# EAGLE design Ad7124-4_FB_FeatherWing (EAGLE 9.6.2)
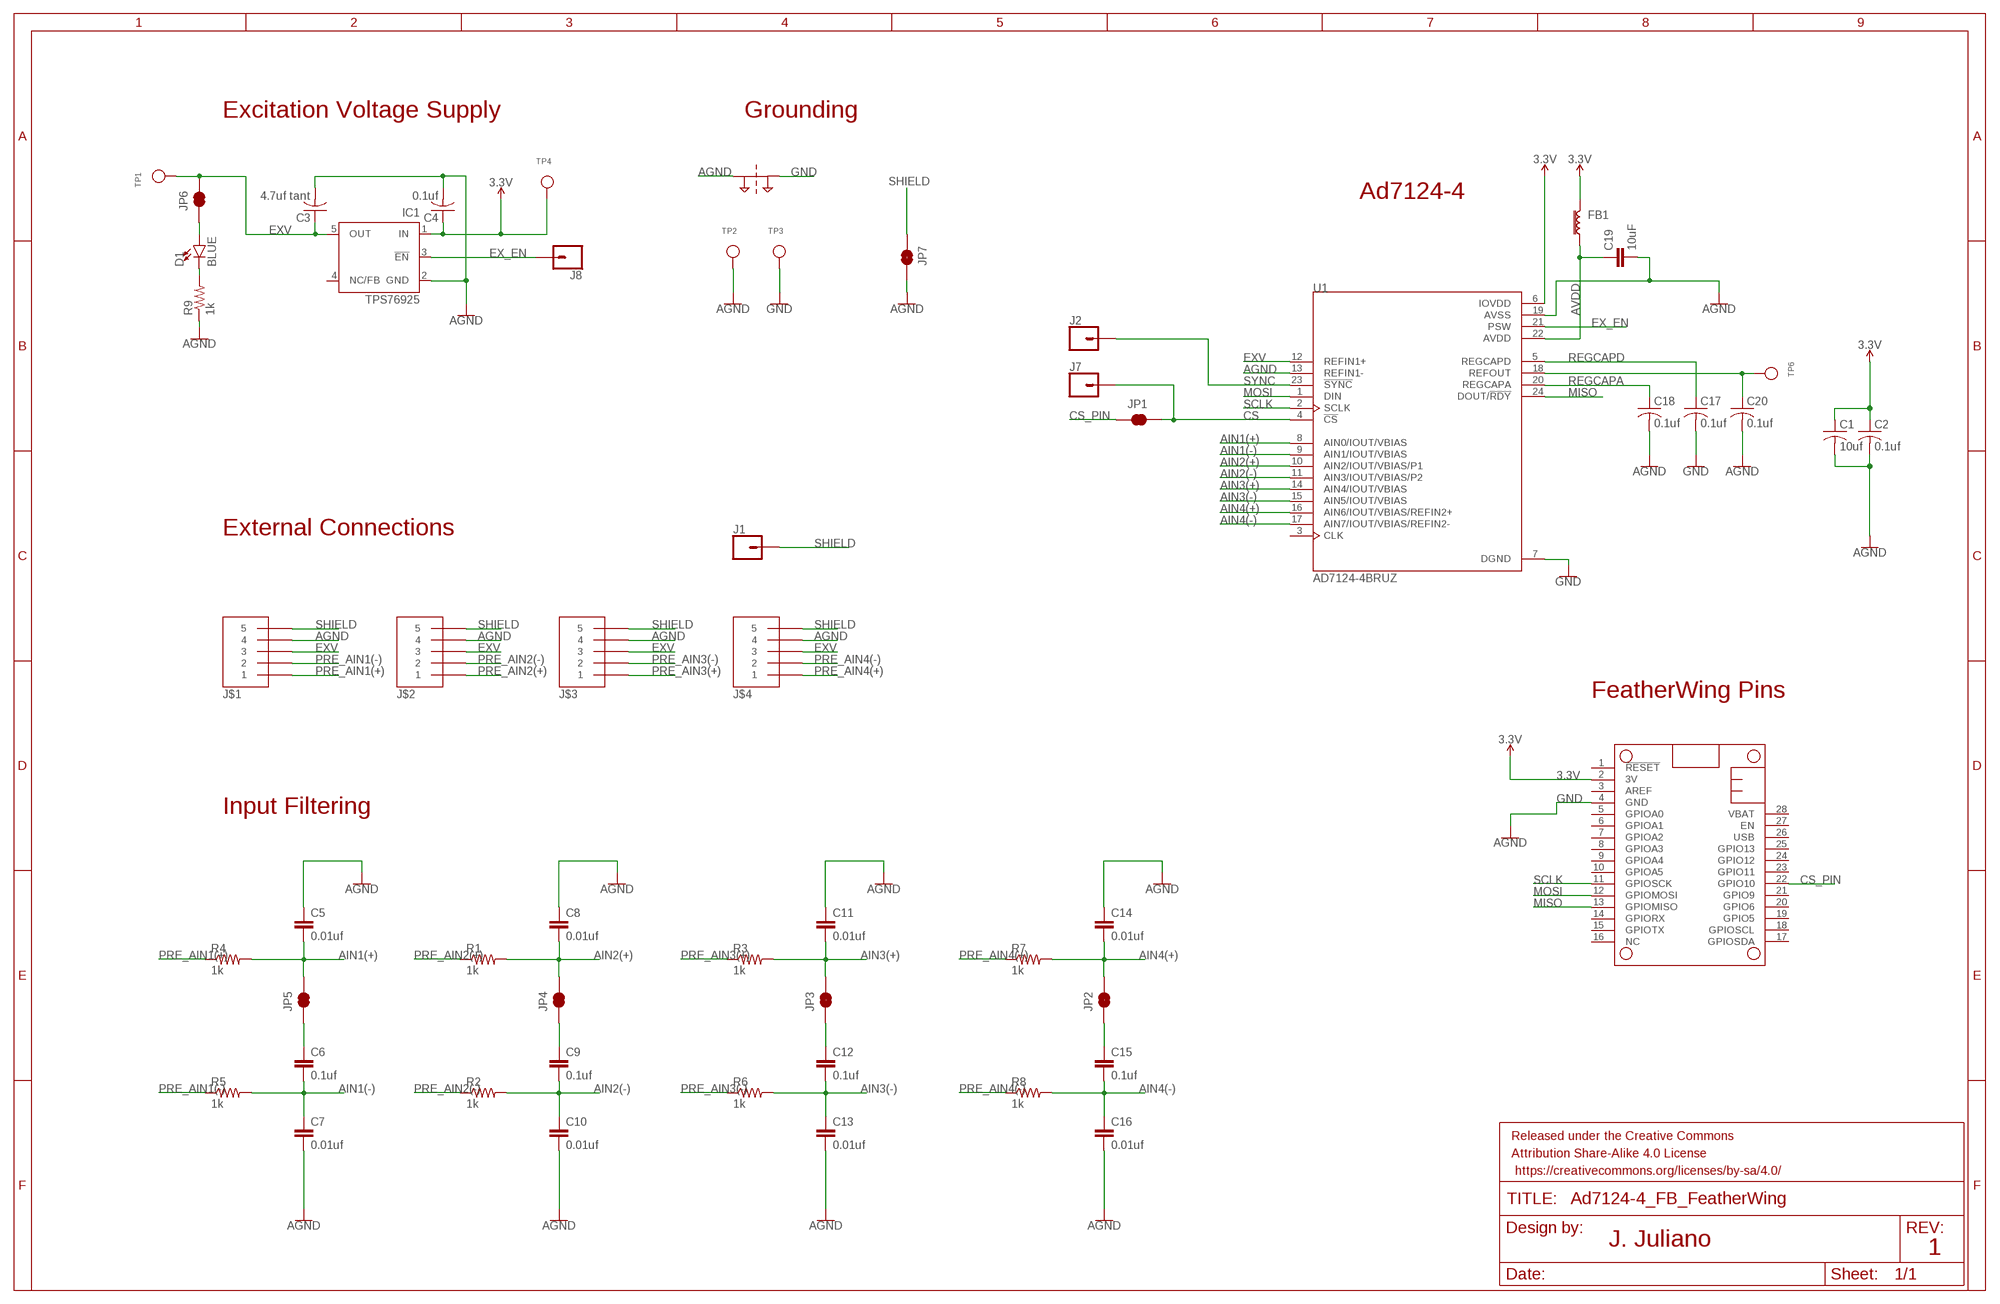
[diagram p0: schematic, sheet 1]

## Parts
C1  10uf  C-USC0603  [C0603]
C2  0.1uf  C-USC0603  [C0603]
C3  4.7uf tant  C-USC0603  [C0603]
C4  0.1uf  C-USC0603  [C0603]
C5  0.01uf  C-EUC0603  [C0603]
C6  0.1uf  C-EUC0603  [C0603]
C7  0.01uf  C-EUC0603  [C0603]
C8  0.01uf  C-EUC0603  [C0603]
C9  0.1uf  C-EUC0603  [C0603]
C10  0.01uf  C-EUC0603  [C0603]
C11  0.01uf  C-EUC0603  [C0603]
C12  0.1uf  C-EUC0603  [C0603]
C13  0.01uf  C-EUC0603  [C0603]
C14  0.01uf  C-EUC0603  [C0603]
C15  0.1uf  C-EUC0603  [C0603]
C16  0.01uf  C-EUC0603  [C0603]
C17  0.1uf  C-USC0603  [C0603]
C18  0.1uf  C-USC0603  [C0603]
C19  10uF  10UF-0603-6.3V-20%  [0603]
C20  0.1uf  C-USC0603  [C0603]
D1  BLUE  LED-BLUE0603  [LED-0603]
FB1  FERRITE_BEAD-0603  [0603]
FRAME2  FRAME-LETTER  [CREATIVE_COMMONS]
IC1  TPS76925  TPS77025  [SOT23-DBV]
J1  CONN_01PTH_NO_SILK_YES_STOP  [1X01_NO_SILK]
J2  CONN_01PTH_NO_SILK_YES_STOP  [1X01_NO_SILK]
J7  CONN_01PTH_NO_SILK_YES_STOP  [1X01_NO_SILK]
J8  CONN_01PTH_NO_SILK_YES_STOP  [1X01_NO_SILK]
J$1  CON_PTSM_SOCKET-5-PTH-VERT  [CON_PTSM_SOCKET-5-PTH-VERT]
J$2  CON_PTSM_SOCKET-5-PTH-VERT  [CON_PTSM_SOCKET-5-PTH-VERT]
J$3  CON_PTSM_SOCKET-5-PTH-VERT  [CON_PTSM_SOCKET-5-PTH-VERT]
J$4  CON_PTSM_SOCKET-5-PTH-VERT  [CON_PTSM_SOCKET-5-PTH-VERT]
JP1  JUMPER-SMT_2_NC_TRACE_NO-SILK  [SMT-JUMPER_2_NC_TRACE_NO-SILK]
JP2  JUMPER-SMT_2_NC_TRACE_NO-SILK  [SMT-JUMPER_2_NC_TRACE_NO-SILK]
JP3  JUMPER-SMT_2_NC_TRACE_NO-SILK  [SMT-JUMPER_2_NC_TRACE_NO-SILK]
JP4  JUMPER-SMT_2_NC_TRACE_NO-SILK  [SMT-JUMPER_2_NC_TRACE_NO-SILK]
JP5  JUMPER-SMT_2_NC_TRACE_NO-SILK  [SMT-JUMPER_2_NC_TRACE_NO-SILK]
JP6  JUMPER-SMT_2_NC_TRACE_NO-SILK  [SMT-JUMPER_2_NC_TRACE_NO-SILK]
JP7  JUMPER-SMT_2_NO_NO-SILK  [SMT-JUMPER_2_NO_NO-SILK]
MS1  FEATHERWING_NODIM  [FEATHERWING_DIM]
R1  1k  R-US_R0603  [R0603]
R2  1k  R-US_R0603  [R0603]
R3  1k  R-US_R0603  [R0603]
R4  1k  R-US_R0603  [R0603]
R5  1k  R-US_R0603  [R0603]
R6  1k  R-US_R0603  [R0603]
R7  1k  R-US_R0603  [R0603]
R8  1k  R-US_R0603  [R0603]
R9  1k  R-US_R0603  [R0603]
SUPPLY6  2PT_GND_TIE  [2PT_GND_TIE]
TP1  TESTPOINTROUND1MM  [TESTPOINT_ROUND_1MM]
TP2  TESTPOINTROUND1MM  [TESTPOINT_ROUND_1MM]
TP3  TESTPOINTROUND1MM  [TESTPOINT_ROUND_1MM]
TP4  TESTPOINTROUND1MM  [TESTPOINT_ROUND_1MM]
TP6  TESTPOINTROUND1MM  [TESTPOINT_ROUND_1MM]
U1  AD7124-4BRUZ  [SOP65P640X120-24N]

## Nets
3.3V: C1.1 C2.1 C4.1 FB1.2 IC1.1(IN) MS1.2(3V) TP4.P$1 U1.6(IOVDD)
AGND: C5.1 C7.2 C8.1 C10.2 C11.1 C13.2 C14.1 C16.2 C18.2 C19.2 C20.2 J$1.P$4 J$2.P$4 J$3.P$4 J$4.P$4 JP7.2 R9.1 SUPPLY6.P$1 TP2.P$1 U1.13(REFIN1-) U1.19(AVSS)
AIN1(+): C5.2 JP5.2 R4.2 U1.8(AIN0/IOUT/VBIAS)
AIN1(-): C6.2 C7.1 R5.2 U1.9(AIN1/IOUT/VBIAS)
AIN2(+): C8.2 JP4.2 R1.2 U1.10(AIN2/IOUT/VBIAS/P1)
AIN2(-): C9.2 C10.1 R2.2 U1.11(AIN3/IOUT/VBIAS/P2)
AIN3(+): C11.2 JP3.2 R3.2 U1.14(AIN4/IOUT/VBIAS)
AIN3(-): C12.2 C13.1 R6.2 U1.15(AIN5/IOUT/VBIAS)
AIN4(+): C14.2 JP2.2 R7.2 U1.16(AIN6/IOUT/VBIAS/REFIN2+)
AIN4(-): C15.2 C16.1 R8.2 U1.17(AIN7/IOUT/VBIAS/REFIN2-)
AVDD: C19.1 FB1.1 U1.22(AVDD)
CS: J7.1 JP1.2 U1.4(!CS)
CS_PIN: JP1.1 MS1.22(GPIO10)
EX_EN: IC1.3(!EN) J8.1 U1.21(PSW)
EXV: C3.1 IC1.5(OUT) J$1.P$3 J$2.P$3 J$3.P$3 J$4.P$3 JP6.2 TP1.P$1 U1.12(REFIN1+)
GND: C1.2 C2.2 C3.2 C4.2 C17.2 IC1.2(GND) MS1.4(GND) SUPPLY6.P$2 TP3.P$1 U1.7(DGND) ; supply symbol labelled AGND
MISO: MS1.13(GPIOMISO) U1.24(DOUT/!RDY)
MOSI: MS1.12(GPIOMOSI) U1.1(DIN)
N$1: D1.A JP6.1
N$2: C15.1 JP2.1
N$3: C12.1 JP3.1
N$4: D1.C R9.2
N$5: C9.1 JP4.1
N$6: C6.1 JP5.1
N$7: C20.1 TP6.P$1 U1.18(REFOUT)
PRE_AIN1(+): J$1.P$1 R4.1
PRE_AIN1(-): J$1.P$2 R5.1
PRE_AIN2(+): J$2.P$1 R1.1
PRE_AIN2(-): J$2.P$2 R2.1
PRE_AIN3(+): J$3.P$1 R3.1
PRE_AIN3(-): J$3.P$2 R6.1
PRE_AIN4(+): J$4.P$1 R7.1
PRE_AIN4(-): J$4.P$2 R8.1
REGCAPA: C18.1 U1.20(REGCAPA)
REGCAPD: C17.1 U1.5(REGCAPD)
SCLK: MS1.11(GPIOSCK) U1.2(SCLK)
SHIELD: J1.1 J$1.P$5 J$2.P$5 J$3.P$5 J$4.P$5 JP7.1
SYNC: J2.1 U1.23(!SYNC)
Unconnected: IC1.4(NC/FB) MS1.1(!RESET) MS1.3(AREF) MS1.5(GPIOA0) MS1.6(GPIOA1) MS1.7(GPIOA2) MS1.8(GPIOA3) MS1.9(GPIOA4) MS1.10(GPIOA5) MS1.14(GPIORX) MS1.15(GPIOTX) MS1.16(NC) MS1.17(GPIOSDA) MS1.18(GPIOSCL) MS1.19(GPIO5) MS1.20(GPIO6) MS1.21(GPIO9) MS1.23(GPIO11) MS1.24(GPIO12) MS1.25(GPIO13) MS1.26(USB) MS1.27(EN) MS1.28(VBAT) U1.3(CLK)

## Notes on the sheet
- Excitation Voltage Supply | Grounding
- Ad7124-4
- External Connections
- FeatherWing Pins
- Input Filtering
- J. Juliano
- 1

## Library data of the parts
C1-C4 C17 C18 C20 = rcl:C-US: CAPACITOR, American symbol
C5-C16 = rcl:C-EU: CAPACITOR, European symbol; SPICEPREFIX: C
C19 = SparkFun-Capacitors:10UF: 10.0µF ceramic capacitors A capacitor is a passive two-terminal electrical component used to store electrical energy temporarily in an electric field.; PROD_ID: CAP-11015
D1 = SparkFun-LED:LED-BLUE: Blue SMD LED Used in manufacturing of various products at SparkFun Packages: 0603 - SMD 0603 package [Product Link] <http://www.digikey.com/product-detail/en/SMLE12BC7TT86/511-1589-2-ND/1641808> 1206 - SMD1206 package [Product Link] <http://www.digikey.com/product-detail/en/lite-on-inc/LTST-C150TBKT/160-1643-1-ND/573584> SparkFun Products: ESP8266 Thing-Dev Board <https://www.sparkfun.com/products/13711> RedBoard <https://www.sparkfun.com/products/12757>; PROD_ID: DIO-08575
FB1 = SparkFun-Coils:FERRITE_BEAD: Ferrite Bead (blocks, cores, rings, chokes, etc.) Inductor with layers of ferrite used to suppress high frequencies. Often used to isolate high frequency noise. SparkFun Products: IOIO-OTG - V2.2 <https://www.sparkfun.com/products/13613> SparkFun SAMD21 Mini Breakout <https://www.sparkfun.com/products/13664> SparkFun 6 Degrees of Freedom Breakout - LSM6DS3 <https://www.sparkfun.com/products/13339> SparkFun SAMD21 Dev Breakout <https://www.sparkfun.com/products/13672>; PROD_ID: NDUC-07859; VALUE: 30Ω/1.8A
FRAME2 = SparkFun-Aesthetics:FRAME-LETTER: Schematic Frame - Letter Standard 8.5x11 US Letter frame
IC1 = texas:TPS770*: ULTRALOW-POWER 50-mA LOW-DROPOUT LINEAR REGULATORS 50-mA Low-Dropout Regulator Source: http://focus.ti.com/lit/ds/symlink/tps77001.pdf
J1 J2 J7 J8 = SparkFun-Connectors:CONN_01: Single connection point. Often used as Generic Header-pin footprint for 0.1 inch spaced/style header connections On any of the 0.1 inch spaced packages, you can populate with these: Break Away Headers - Straight <https://www.sparkfun.com/products/116> (PRT-00116) Break Away Male Headers - Right Angle <https://www.sparkfun.com/products/553> (PRT-00553) Female Headers <https://www.sparkfun.com/products/115> (PRT-00115) Break Away Headers - Machine Pin <https://www.sparkfun.com/products/117> (PRT-00117) Break Away Female Headers - Swiss Machine Pin <https://www.sparkfun.com/products/743> (PRT-00743) This device is also useful as a general connection point to wire up your design to another part of your project. Our various solder wires solder well into these plated through hole pads. Hook-Up Wire - Assortment (Stranded, 22 AWG) <https://www.sparkfun.com/products/11375> (PRT-11375) Hook-Up Wire - Assortment (Solid Core, 22 AWG) <https://www.sparkfun.com/products/11367> (PRT-11367) View the entire wire category on our website here <https://www.sparkfun.com/categories/141> Special notes: SMTSO-256-ET is a "flush mount" nut for a 4-40 screw. We mostly use this on specialty testbeds; it is a nice way to connect hardware to your PCB at an adjustable hieght. Also note, the SNAP packages are for using a snappable style connector. We sell a baggie of snaps and they are also used on two LilyPad designs: Snap Assortment - 30 pack (male and female) <https://www.sparkfun.com/products/11347> (DEV-11347) LilyPad Arduino SimpleSnap <https://www.sparkfun.com/products/10941> (DEV-10941) LilyPad SimpleSnap Protoboard <https://www.sparkfun.com/products/10940> (DEV-10940)
J$1-J$4 = PikiTech:CON_PTSM_SOCKET-5-PTH-VERT
JP1-JP6 = SparkFun-Jumpers:JUMPER-SMT_2_NC_TRACE: Normally closed trace jumper This jumper has a trace between two pads so it's normally closed (NC). Use a razor knife to open the connection. For best results follow the IPC guidelines for cutting traces: Cutout at least 0.063 mm (0.005 in). Remove all loose material to clean up the cut area. Seal the cut with an approved epoxy. Reapply solder to reclose the connection.
JP7 = SparkFun-Jumpers:JUMPER-SMT_2_NO: Normally open jumper This jumper has two pads in close proximity to each other. Apply solder to close the connection. Round pads are easier to solder for beginners, but are a lot larger. SparkFun Product that uses the round pads: SparkFun EL Sequencer <https://www.sparkfun.com/products/12781>
MS1 = adafruit:FEATHERWING
R1-R9 = rcl:R-US_: RESISTOR, American symbol; SPICEPREFIX: R
SUPPLY6 = SparkFun-PowerSymbols:2PT_GND_TIE: Dual Ground Supply Power supply symbol for connecting two grounds. SparkFun Products: SparkFun AutoDriver - Stepper Motor Driver <https://www.sparkfun.com/products/11611>
TP1-TP4 TP6 = microbuilder:TESTPOINT: Test Point Various test points for characterisation and PCB testing TESTPOINT_SMT - Compact Surface Mount Test Point [Digikey: 5016KTR-ND]
U1 = AD7124-4BRUZ:AD7124-4BRUZ: 7-Channel Single ADC Delta-Sigma 24-bit Serial 24-Pin TSSOP Tube; AVAILABILITY: Unavailable; DESCRIPTION: 24 Bit Analog to Digital Converter 4, 7 Input 1 Sigma-Delta 24-TSSOP; MF: Analog Devices; MP: AD7124-4BRUZ; PACKAGE: TSSOP-24 Analog Devices; PRICE: None

## Board
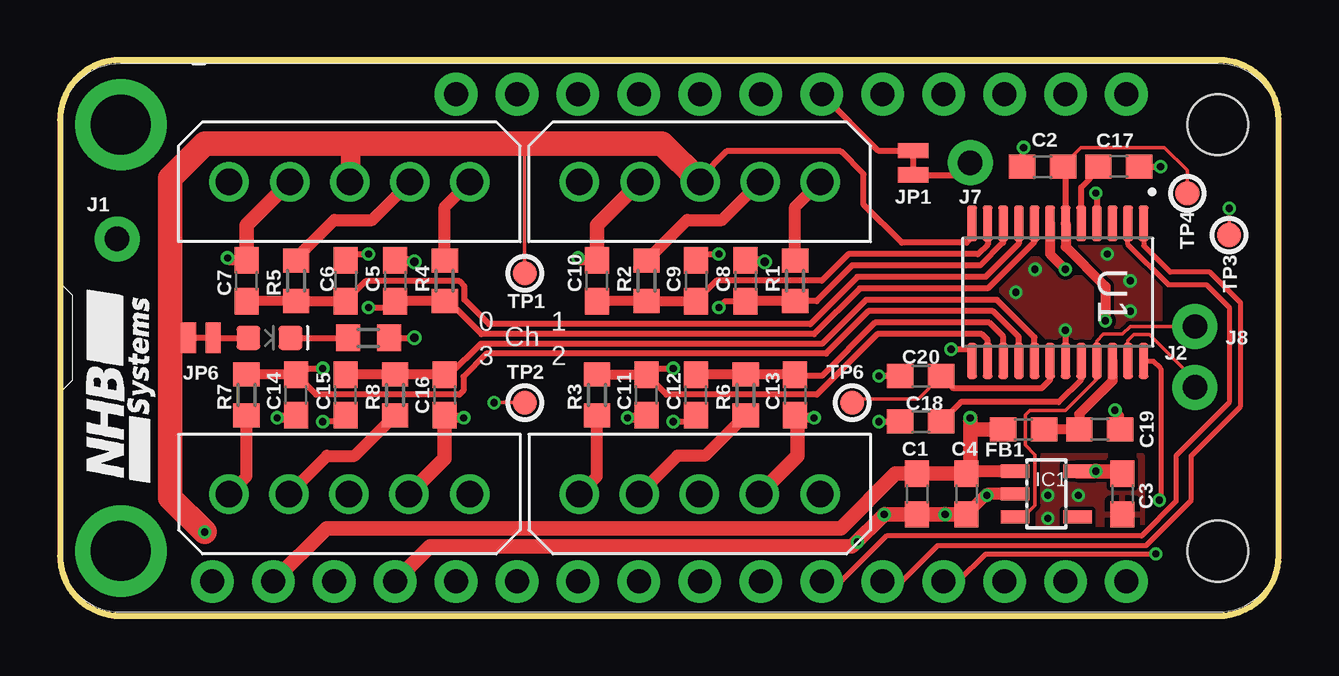
[diagram p1: board, top side]
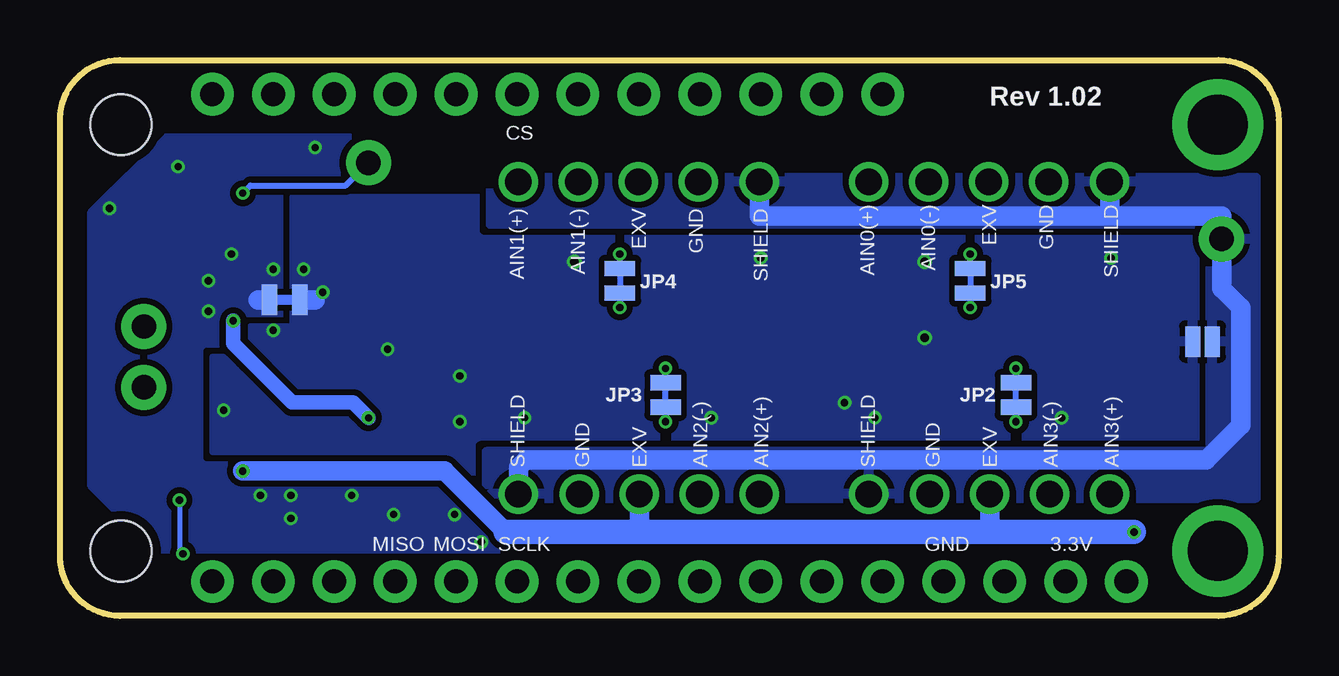
[diagram p2: board, bottom side, seen from below]

Size 50.8 x 23.18 mm. Coordinates in mm from the lower left corner, seen from the top.
Outline: 2.5,0 48.3,0 arc90 50.8,2.5 50.8,20.68 arc90 48.3,23.18 2.5,23.18 arc90 0,20.68 0,2.5 arc90 2.5,0
Copper layers (1*16): Top 0.035559375mm / dielectric 1.6mm / Bottom 0.035559375mm
Design rules "oshpark-2layer *": minimum track width 6mil, minimum drill 10mil, track to track 6mil, track to pad 6mil, pad to pad 6mil, via to via 6mil, smd to smd 6mil, copper to edge 15mil, drill to drill 6mil, minimum pad ring 5mil, minimum via ring 5mil, stop-mask expansion 2.5mil, vias tented up to drill 0mil, thermal gap 10mil

### Footprints (pad centres in the part's own frame; a part is rotated, then mirrored left to right if it is on the bottom)
C0603 = smd 1.1 x 1: 1 -0.85,0; 2 0.85,0
0603 = smd 1.1 x 1: 1 -0.85,0; 2 0.85,0
LED-0603 = smd 1 x 1: A -0.877,0; C 0.877,0
SOT23-DBV = smd 0.55 x 1.2: 1 -0.95,-1.3; 2 0,-1.3; 3 0.95,-1.3; 4 0.95,1.3; 5 -0.95,1.3
1X01_NO_SILK = drill 1.016 pad 1.88: 1 0,0
CON_PTSM_SOCKET-5-PTH-VERT = drill 1.1: P$1 -5.02,0; P$2 -2.52,0; P$3 -0.02,0; P$4 2.48,0; P$5 5.02,0
SMT-JUMPER_2_NC_TRACE_NO-SILK = smd 0.635 x 1.27: 1 -0.508,0; 2 0.508,0
SMT-JUMPER_2_NO_NO-SILK = smd 0.635 x 1.27: 1 -0.406,0; 2 0.406,0
FEATHERWING_DIM = drill 1 pad 1.778: 1 6.35,1.27; 2 8.89,1.27; 3 11.43,1.27; 4 13.97,1.27; 5 16.51,1.27; 6 19.05,1.27; 7 21.59,1.27; 8 24.13,1.27; 9 26.67,1.27; 10 29.21,1.27; 11 31.75,1.27; 12 34.29,1.27; 13 36.83,1.27; 14 39.37,1.27; 15 41.91,1.27; 16 44.45,1.27; 17 44.45,21.59; 18 41.91,21.59; 19 39.37,21.59; 20 36.83,21.59; 21 34.29,21.59; 22 31.75,21.59; 23 29.21,21.59; 24 26.67,21.59; 25 24.13,21.59; 26 21.59,21.59; 27 19.05,21.59; 28 16.51,21.59 | drill 2.5 pad 3.81: P$1 2.54,20.32; P$2 2.54,2.54 | hole 2.54: 48.26,20.32; 48.26,2.54
R0603 = smd 1 x 1.1: 1 -0.85,0; 2 0.85,0
2PT_GND_TIE = smd 1.27 x 0.635: P$1 0,0.635; P$2 0,-0.635
TESTPOINT_ROUND_1MM = smd 1 x 1: P$1 0,0
SOP65P640X120-24N = smd 1.49 x 0.41: 1 -2.87,3.575; 2 -2.87,2.925; 3 -2.87,2.275; 4 -2.87,1.625; 5 -2.87,0.975; 6 -2.87,0.325; 7 -2.87,-0.325; 8 -2.87,-0.975; 9 -2.87,-1.625; 10 -2.87,-2.275; 11 -2.87,-2.925; 12 -2.87,-3.575; 13 2.87,-3.575; 14 2.87,-2.925; 15 2.87,-2.275; 16 2.87,-1.625; 17 2.87,-0.975; 18 2.87,-0.325; 19 2.87,0.325; 20 2.87,0.975; 21 2.87,1.625; 22 2.87,2.275; 23 2.87,2.925; 24 2.87,3.575

### Placement (x,y rotation side)
C1  35.72,5.08 270 top
C2  40.96,18.73 180 top
C3  44.29,5.08 270 top
C4  37.78,5.08 270 top
C5  13.97,13.97 270 top
C6  11.91,13.97 270 top
C7  7.78,13.97 90 top
C8  28.57,13.97 270 top
C9  26.51,13.97 270 top
C10  22.38,13.97 90 top
C11  24.45,9.21 90 top
C12  26.51,9.21 90 top
C13  30.64,9.21 270 top
C14  9.84,9.21 90 top
C15  11.91,9.21 90 top
C16  16.03,9.21 270 top
C17  44.13,18.73 0 top
C18  35.88,8.1 180 top
C19  43.34,7.78 0 top
C20  35.88,10 180 top
D1  8.73,11.59 0 top
FB1  40.16,7.78 180 top
FRAME2  4.92,-9.21 0 top  (outside the outline)
IC1  41.12,5.08 270 top
J1  2.38,15.72 0 top
J2  47.31,9.53 0 top
J7  37.94,18.89 0 top
J8  47.31,12.06 0 top
J$1  12.06,18.1 180 top
J$2  26.67,18.1 180 top
J$3  26.67,5.08 0 top
J$4  12.06,5.08 0 top
JP1  35.56,18.89 270 top
JP2  10.95,9.21 90 bottom
JP3  25.56,9.21 90 bottom
JP4  27.46,13.97 270 bottom
JP5  12.86,13.97 270 bottom
JP6  5.87,11.59 180 top
JP7  3.17,11.43 180 bottom
MS1  0,0.16 0 top
R1  30.64,13.97 270 top
R2  24.45,13.97 270 top
R3  22.38,9.21 90 top
R4  16.03,13.97 270 top
R5  9.84,13.97 270 top
R6  28.57,9.21 90 top
R7  7.78,9.21 90 top
R8  13.97,9.21 90 top
R9  12.86,11.59 180 top
SUPPLY6  41.43,13.18 270 bottom
TP1  19.37,14.29 0 top
TP2  19.37,8.89 0 top
TP3  48.74,15.88 0 top
TP4  46.99,17.62 0 top
TP6  33.02,8.89 0 top
U1  41.59,13.49 270 top
U$5  [NHB_COMPACT_LOGO_SMALL]  3.17,5.87 90 top

### Tracks (layer width: path | path; a pad name or v marks a point on that pad's centre or on a via)
3.3V  (via drill 0.3)
  Top 0.152: TP4.P$1 46.99,18.57 46.04,19.53 42.55,19.53 41.81,18.79 C2.1
  Top 0.254: C2.1 41.92,18.62 U1.6
  Top 0.406: U1.6 41.92,15.39 43.58,13.73 v43.58,12.3
  Top 0.508: IC1.1 37.88,6.03 C4.1
  Top 0.61: MS1.2 11.11,3.65 32.54,3.65 34.82,5.93 C1.1 C4.1 37.94,6.09 v37.94,8.25 37.94,7.78 FB1.2
  Bottom 0.61: v37.94,8.25 38.58,8.89 41.12,8.89 43.58,11.35 v43.58,12.3
AGND  (via drill 0.3, 0.35)
  Top 0.152: TP2.P$1 v18.1,8.89
  Top 0.254: U1.19 v41.92,11.91 v41.91,11.91 | U1.13 38.02,11.1 38.01,11.11 v37.15,11.11 | C20.2 v34.13,10 | v34.13,8.1 C18.2 | R9.1 v14.76,11.59
  Top 0.305: C19.2 44.19,8.36 v43.97,8.57
  Top 0.406: C13.2 30.74,8.25 v31.43,8.25 | v14.76,14.76 14.03,14.76 | C11.1 24.34,8.25 v23.65,8.25 | v29.37,14.76 28.63,14.76 C8.1 | C14.1 9.74,8.25 v9.05,8.25 | v16.83,8.25 16.14,8.25 C16.2 | C7.2 7.09,14.82 v6.99,14.92 | C10.2 21.69,14.82 v21.59,14.92
  Top 0.61: C5.1 14.03,14.76 | J$1.P$4 7.78,16.29 C7.2 | J$2.P$4 22.38,16.29 C10.2 | J$3.P$4 30.74,6.67 30.74,8.25 | J$4.P$4 16.03,6.57 C16.2
  Bottom 0.813: SUPPLY6.P$1 40.16,13.18
  other vias: 39.85,13.49 40.64,14.45
  pour Bottom (isolate 0.254, rank 2): 2.86,17.46 31.59,17.46 31.59,6.03 2.86,6.03
  pour Bottom (isolate 0.254, rank 2, no thermals): 31.11,17.46 41.12,17.46 41.12,12.06 42.86,12.06 42.86,6.19 33.97,6.19 33.02,5.24 31.11,5.24
  pour Bottom (isolate 0.254): 40.16,10.79 44.45,10.79 44.45,6.83 40.16,6.83
  pour Top: 39.21,13.65 40.48,14.92 40.8,14.92 41.59,14.13 43.02,14.13 43.02,11.59 41.12,11.59 39.21,13.49
AIN1(+)  (via drill 0.3)
  Top 0.254: U1.8 40.61,16.36 40.61,15.59 38.67,13.65 33.34,13.65 31.43,11.75 17.57,11.75 16.19,13.12 R4.2 | v12.86,12.86 13.71,12.86 C5.2
  Top 0.406: R4.2 C5.2
  Bottom 0.254: JP5.2 v12.86,12.86
AIN1(-)
  Top 0.254: U1.9 39.97,15.52 38.58,14.13 33.24,14.13 31.28,12.17 17.88,12.17 16.86,13.18 16.86,13.74 16.65,13.95 12.74,13.95 C6.2
  Top 0.406: C7.1 R5.2 C6.2
AIN2(+)  (via drill 0.3)
  Top 0.254: U1.10 39.31,16.36 39.31,15.56 38.36,14.6 33.02,14.6 31.54,13.12 R1.2 | v27.46,12.86 27.73,13.12 C8.2
  Top 0.406: R1.2 C8.2
  Bottom 0.254: JP4.2 v27.46,12.86
AIN2(-)
  Top 0.254: U1.11 38.67,15.49 38.26,15.08 32.86,15.08 31.75,13.97 27.36,13.97 C9.2
  Top 0.406: C10.1 R2.2 C9.2
AIN3(+)  (via drill 0.3)
  Top 0.254: U1.14 38.67,11.5 38.42,11.75 34.07,11.75 31.55,9.23 25.28,9.23 C11.2 24.71,10.32 v25.56,10.32
  Top 0.406: R3.2 C11.2
  Bottom 0.254: JP3.2 v25.56,10.32
AIN3(-)
  Top 0.254: U1.15 39.32,11.64 38.73,12.22 33.97,12.22 31.75,10 30.7,10 C13.1
  Top 0.406: C13.1 R6.2 C12.2
AIN4(+)  (via drill 0.3)
  Top 0.254: U1.16 39.97,11.63 38.89,12.7 33.69,12.7 31.93,10.93 17.78,10.93 16.81,9.97 16.81,9.39 16.65,9.23 10.67,9.23 C14.2 10.1,10.32 v10.95,10.32
  Top 0.406: C14.2 R7.2
  Bottom 0.254: JP2.2 v10.95,10.32
AIN4(-)
  Top 0.254: U1.17 40.62,11.61 39.05,13.18 33.59,13.18 31.76,11.34 17.53,11.34 16.25,10.06 C16.1
  Top 0.406: C16.1 R8.2 C15.2
AVDD
  Top 0.406: U1.22 43.87,9.79 42.49,8.41 C19.1 FB1.1
CS  (via drill 0.3)
  Top 0.254: v43.18,17.62 43.22,17.58 U1.4 | JP1.2 37.43,18.38 J7.1
  Bottom 0.254: v43.18,17.62 42.86,17.94 38.89,17.94 J7.1
CS_PIN
  Top 0.254: MS1.22 34.1,19.4 JP1.1
EX_EN
  Top 0.152: IC1.3 40.17,4.13 40.65,4.61 40.65,6.72 40.23,7.13 40.23,8.37 40.42,8.56 41.9,8.56 43.22,9.88 U1.21 43.22,11.47 43.5,11.75 44.29,11.75 44.61,12.06 J8.1
EXV  (via drill 0.3)
  Top 0.152: TP1.P$1 19.37,19.68
  Top 0.254: U1.12 38.02,15.79 37.78,15.56 35.08,15.56 33.5,17.14 33.5,18.41 32.54,19.37 27.78,19.37 26.69,18.28 J$2.P$3 | 4.6,11.59 JP6.2
  Top 0.61: C3.1 44.19,6.03 IC1.5 v43.18,6.03
  Top 0.813: J$1.P$3 12.12,18.13 12.12,19.68
  Top 1.016: v6.03,3.49 4.6,4.92 4.6,11.59 4.6,18.26 6.03,19.68 12.12,19.68 19.37,19.68 25.1,19.68 J$2.P$3
  Bottom 0.813: J$4.P$3 12.04,3.65 12.05,3.64 11.91,3.49 | 32.23,3.49 34.77,6.03 v43.18,6.03 | J$3.P$3 26.65,3.51
  Bottom 1.016: v6.03,3.49 11.91,3.49 26.67,3.49 | 26.67,3.49 32.23,3.49 | 26.65,3.51 26.67,3.49
GND  (via drill 0.3)
  Top 0.152: TP3.P$1 v48.74,16.99 | v38.64,5.02 38.7,5.08 IC1.2
  Top 0.254: C2.2 40.11,19.53 v40.16,19.53 | C17.2 v45.88,18.73
  Top 0.406: U1.7 41.27,15.09 v41.91,14.45
  Top 0.508: C4.2 38.63,5.08 IC1.2
  Top 0.61: MS1.4 15.43,2.89 33.02,2.89 v34.36,4.23 C1.2 C4.2
  Bottom 0.813: SUPPLY6.P$2 42.55,13.18
  other vias: 36.89,4.22 41.18,5.02 42.45,5.02 44.61,12.7 44.61,13.97 43.66,15.08 41.18,4.06 33.24,3.08
  pour Bottom (isolate 0.254, rank 3, no thermals): 31.91,2.7 46.83,2.7 49.53,5.4 49.53,16.83 46.35,20 38.73,20 38.73,17.78 40.8,17.78 40.8,5.87 31.91,5.87
  pour Top: 40.8,6.67 45.09,6.67 45.09,3.81 40.8,3.81
  pour Top (rank 3): 42.39,15.4 45.88,15.4 45.88,10.79 42.39,10.79
MISO  (via drill 0.3)
  Top 0.203: MS1.13 37.44,1.43 38.58,2.57 45.67,2.57 v45.67,2.59 | U1.24 45.56,10.62 45.88,10.31 45.88,4.88 v45.82,4.82
  Bottom 0.203: v45.67,2.59 45.82,2.73 v45.82,4.82
MOSI
  Top 0.203: U1.1 45.17,15.44 46.28,14.33 47.93,14.33 49.21,13.04 49.21,8.73 47.15,6.67 47.15,4.81 45.26,2.93 36.58,2.93 35.08,1.43 MS1.12
N$1
  Top 0.254: JP6.1 D1.A
N$2  (via drill 0.3)
  Top 0.254: C15.1 11.64,8.1 v10.95,8.1
  Bottom 0.254: JP2.1 v10.95,8.1
N$3  (via drill 0.3)
  Top 0.254: v25.56,8.1 26.25,8.1 C12.1
  Bottom 0.254: JP3.1 v25.56,8.1
N$4
  Top 0.254: D1.C R9.2
N$5  (via drill 0.3)
  Top 0.254: C9.1 26.77,15.08 v27.46,15.08
  Bottom 0.254: 27.33,14.34 JP4.1 v27.46,15.08
N$6  (via drill 0.3)
  Top 0.254: C6.1 12.17,15.08 v12.86,15.08
  Bottom 0.254: JP5.1 v12.86,15.08
N$7
  Top 0.152: TP6.P$1 33.18,9.05 35.77,9.05 C20.1
  Top 0.254: C20.1 37.25,9.48 40.91,9.48 41.27,9.83 U1.18
PRE_AIN1(+)
  Top 0.508: R4.1 16.03,17.05 J$1.P$1
PRE_AIN1(-)
  Top 0.406: R5.1 9.84,14.92 | 14.59,18.08 J$1.P$2
  Top 0.508: 9.84,14.92 11.43,16.51 13.02,16.51 14.59,18.08
PRE_AIN2(+)
  Top 0.508: R1.1 30.64,17.05 J$2.P$1
PRE_AIN2(-)
  Top 0.508: R2.1 26.14,16.51 27.6,16.51 J$2.P$2
PRE_AIN3(+)
  Top 0.508: J$3.P$1 22.38,5.81 R3.1
PRE_AIN3(-)
  Top 0.508: R6.1 26.89,6.67 25.74,6.67 J$3.P$2
PRE_AIN4(+)
  Top 0.508: J$4.P$1 7.78,5.81 R7.1
PRE_AIN4(-)
  Top 0.508: J$4.P$2 11.13,6.67 12.28,6.67 R8.1
REGCAPA
  Top 0.254: U1.20 42.57,9.86 41.62,8.92 37.55,8.92 C18.1
REGCAPD
  Top 0.254: C17.1 43.28,18.57 42.57,17.86 U1.5
SCLK
  Top 0.203: MS1.11 32.54,1.43 34.45,3.33 45.09,3.33 46.51,4.76 46.51,6.67 48.74,8.89 48.74,12.86 47.78,13.81 46.2,13.81 44.52,15.49 U1.2
SHIELD
  Bottom 0.813: J$1.P$5 7.04,16.89 6.83,16.67 | 6.83,16.67 2.38,16.67 J1.1 2.38,13.65 1.59,12.86 1.59,7.94 3.02,6.51 31.37,6.51 31.69,6.19 J$3.P$5 | J$2.P$5 21.65,16.68 21.64,16.67 6.83,16.67
  pour Bottom (isolate 0.254): 0.95,18.26 32.86,18.26 32.86,16.35 0.95,16.35
  pour Bottom (isolate 0.254): 0.95,6.83 33.02,6.83 33.02,4.92 0.95,4.92
  pour Bottom: 0.95,17.14 2.86,17.14 2.86,5.87 0.95,5.87
SYNC
  Top 0.152: U1.23 44.52,11.48 44.77,11.73 45.41,11.73 47.31,9.84 J2.1

### Text on the board
tNames: 0 | 1 | Ch | 3 | 2
bNames: Rev 1.02 | CS | SHIELD | GND | EXV | AIN0(-) | AIN0(+) | SHIELD | GND | EXV | AIN1(-) | AIN1(+) | AIN3(+) | AIN3(-) | EXV | GND | SHIELD | AIN2(+) | AIN2(-) | EXV | GND | SHIELD | 3.3V | GND | SCLK | MOSI | MISO
tDocu: J. Juliano